# Altium schematic sheet Decoder.SCHDOC
size A; Organization: Altium Limited; Address1: L3, 12a Rodborough Rd; Address2: Frenchs Forest; Address3: NSW; Address4: Australia 2086; DocumentNumber: 2; SheetNumber: 4; SheetTotal: 5
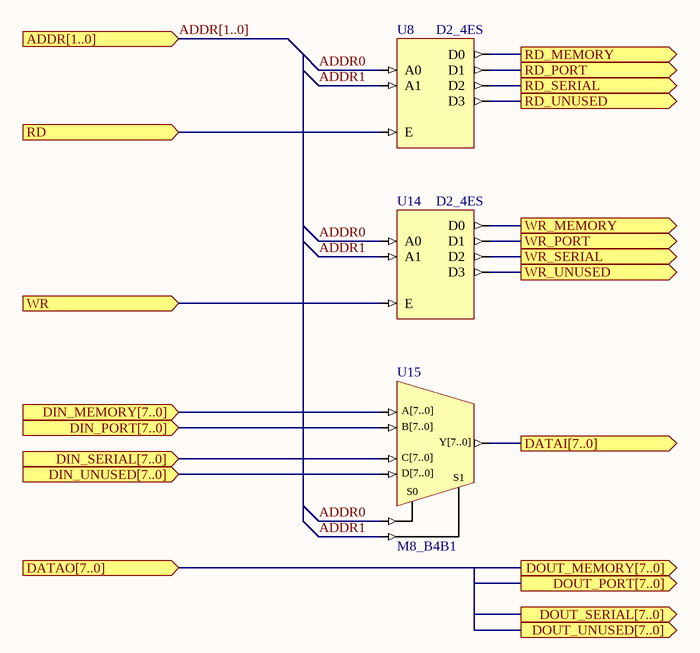
[diagram p0: Decoder.SCHDOC]

## Parts
U8  D2_4ES
U14  D2_4ES
U15  M8_B4B1

## Ports
ADDR[1..0] (in), DATAI[7..0] (out), DATAO[7..0] (in), DIN_MEMORY[7..0] (in), DIN_PORT[7..0] (in), DIN_SERIAL[7..0] (in), DIN_UNUSED[7..0] (in), DOUT_MEMORY[7..0] (out), DOUT_PORT[7..0] (out), DOUT_SERIAL[7..0] (out), DOUT_UNUSED[7..0] (out), RD (in), RD_MEMORY (out), RD_PORT (out), RD_SERIAL (out), RD_UNUSED (out), WR (in), WR_MEMORY (out), WR_PORT (out), WR_SERIAL (out), WR_UNUSED (out)

## Nets
ADDR0: U8.A0 U14.A0 U15.S0
ADDR1: U8.A1 U14.A1 U15.S1
DATAI[7..0]: U15.Y[7..0] ; port DATAI[7..0]
DIN_MEMORY[7..0]: U15.A[7..0] ; port DIN_MEMORY[7..0]
DIN_PORT[7..0]: U15.B[7..0] ; port DIN_PORT[7..0]
DIN_SERIAL[7..0]: U15.C[7..0] ; port DIN_SERIAL[7..0]
DIN_UNUSED[7..0]: U15.D[7..0] ; port DIN_UNUSED[7..0]
RD: U8.E ; port RD
RD_MEMORY: U8.D0 ; port RD_MEMORY
RD_PORT: U8.D1 ; port RD_PORT
RD_SERIAL: U8.D2 ; port RD_SERIAL
RD_UNUSED: U8.D3 ; port RD_UNUSED
WR: U14.E ; port WR
WR_MEMORY: U14.D0 ; port WR_MEMORY
WR_PORT: U14.D1 ; port WR_PORT
WR_SERIAL: U14.D2 ; port WR_SERIAL
WR_UNUSED: U14.D3 ; port WR_UNUSED

## Buses and harness runs
bus ADDR[1..0] = port ADDR[1..0]
bus port DATAO[7..0] = port DOUT_MEMORY[7..0] = port DOUT_PORT[7..0] = port DOUT_SERIAL[7..0] = port DOUT_UNUSED[7..0]

## Notes on the sheet
- Title
- Size:
- Date:
- A
- Number:
- Time:
- Revision:
- Sheet
- of
- File:

## Library data of the parts
U8 U14 = D2_4ES: Binary 2- to 4-Bit Decoder with Enable, Single Pin Version; ArchiveName: GENERIC; Xilinx Equivalent: D2_4E; Published: 18-Dec-2003; Publisher: Altium Limited; Core Revision: 1.00.00
U15 = M8_B4B1: 4x8-Bit Bus to 1x8-Bit Bus Multiplexer; ArchiveName: GENERIC; Published: 18-Dec-2003; Publisher: Altium Limited; Core Revision: 1.00.00